# EAGLE design Sensact v4.1 (EAGLE 8.2.1)
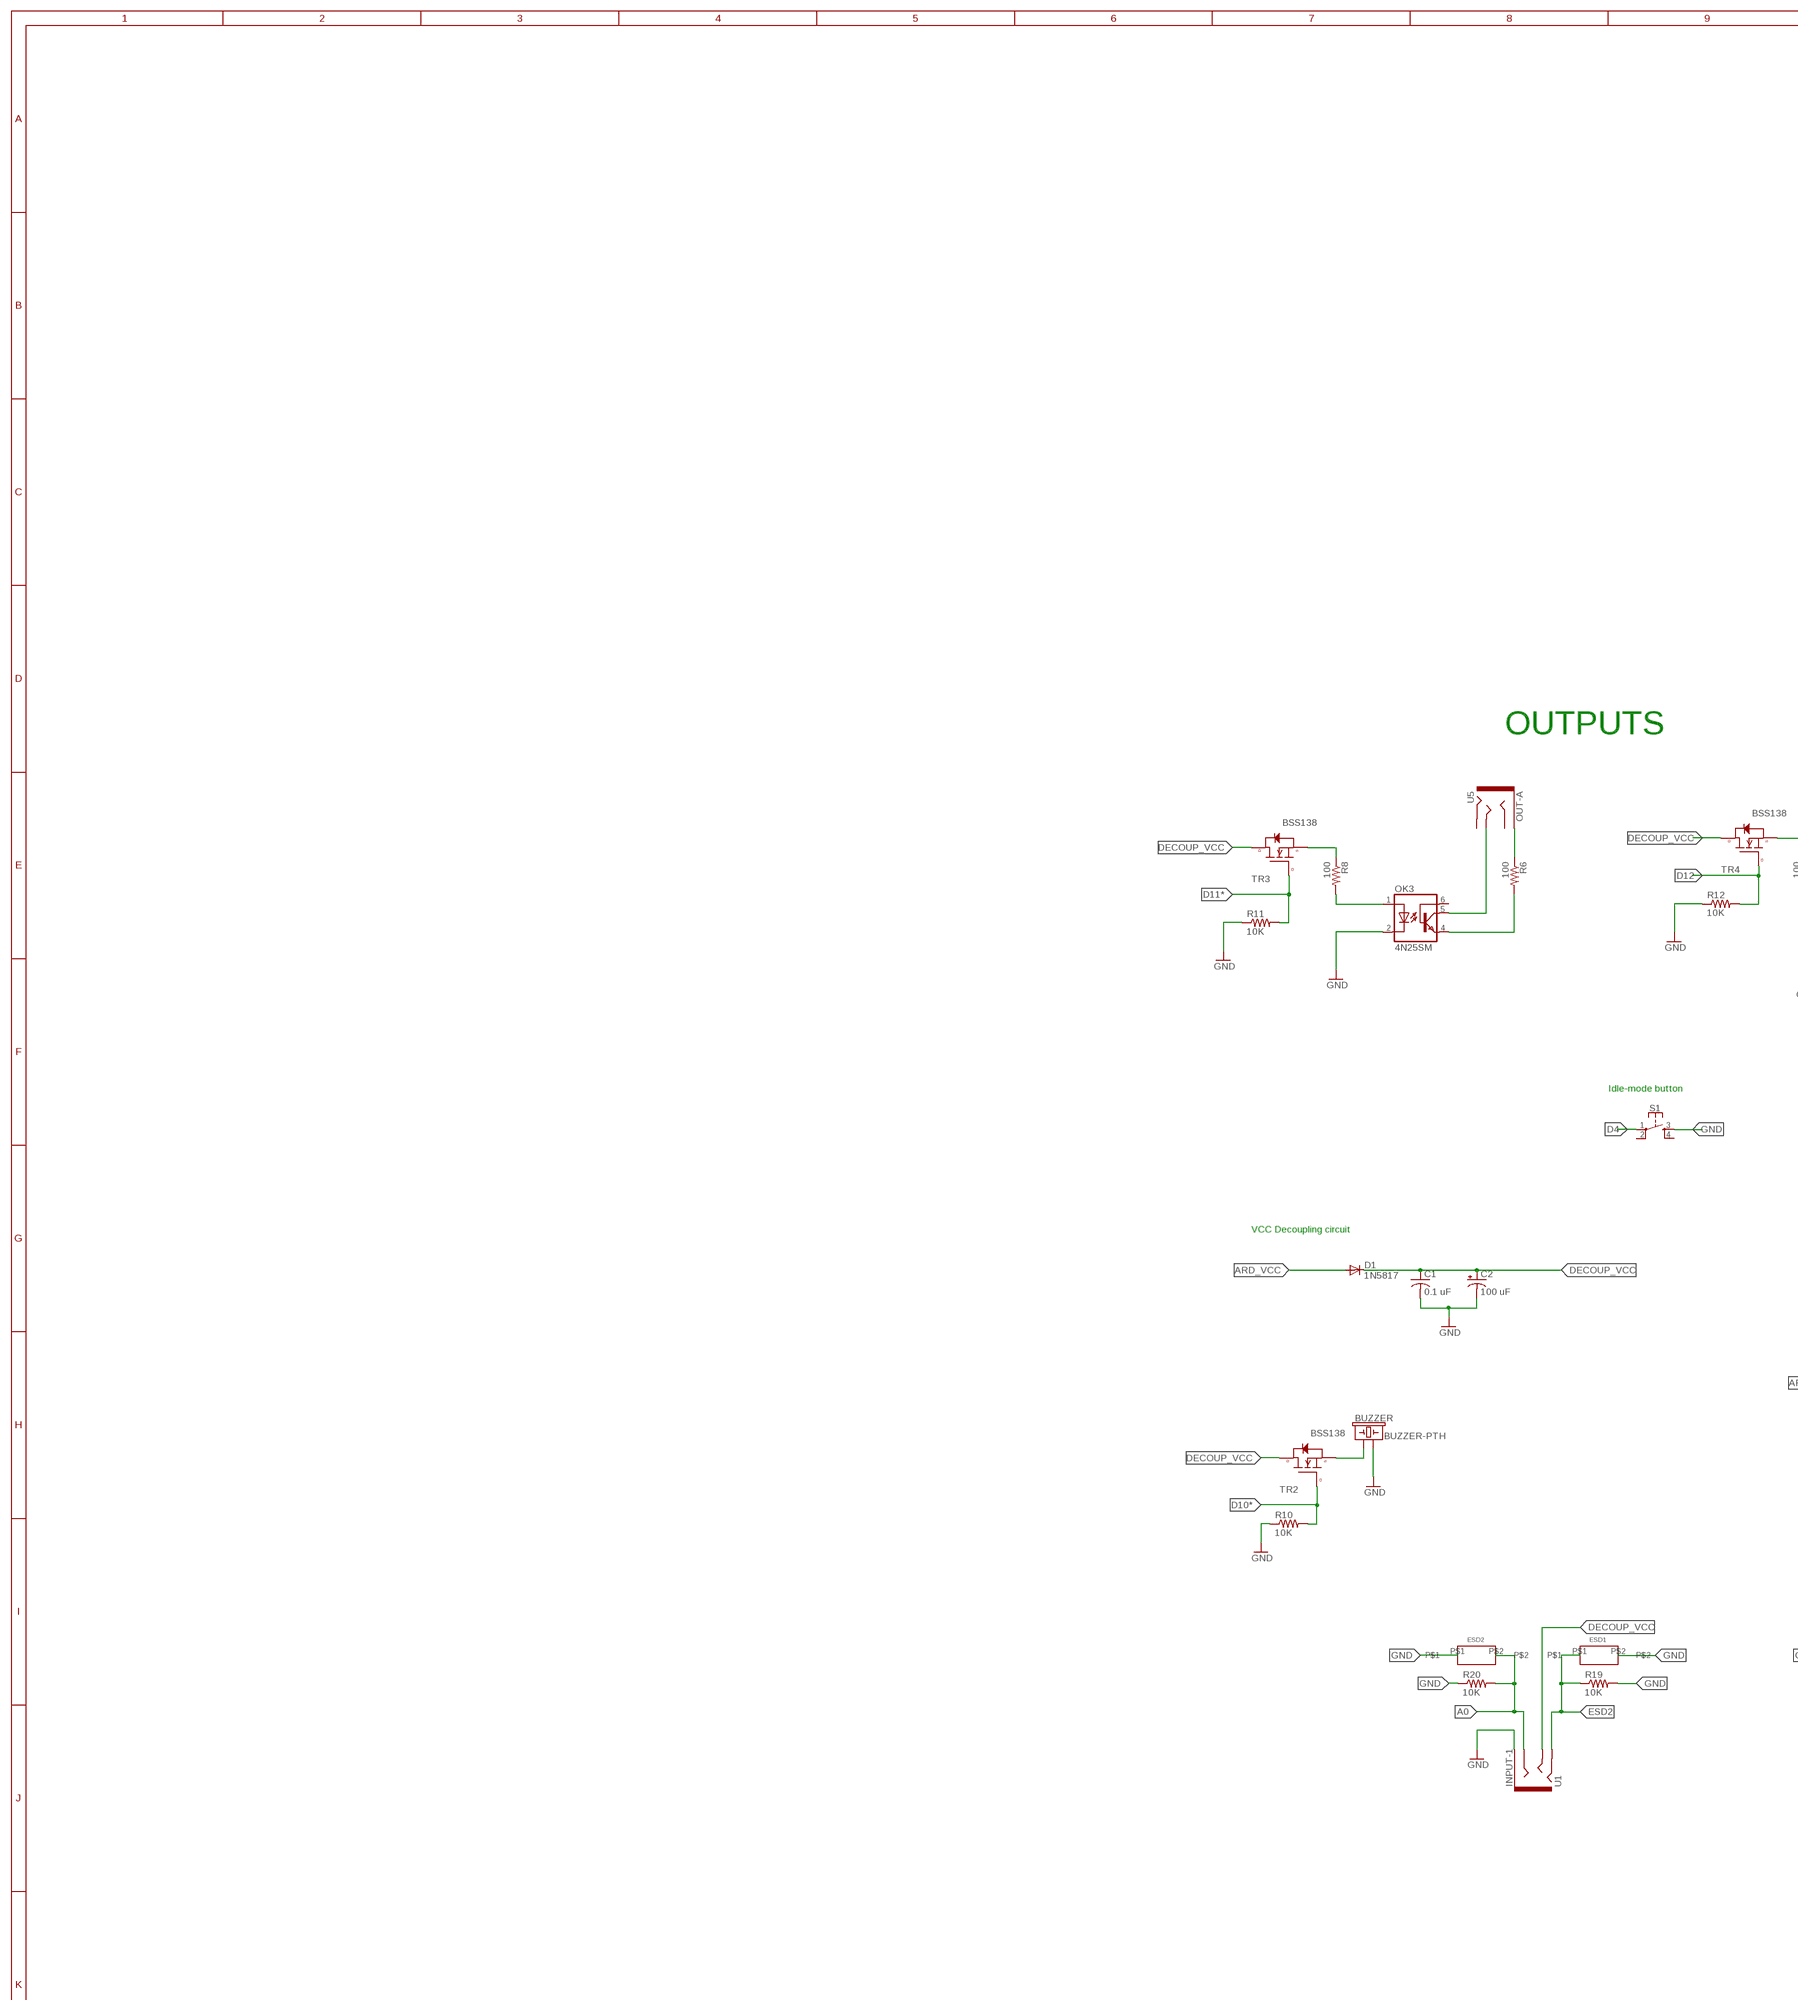
[diagram p0: schematic, sheet 1, part 1 of 3]
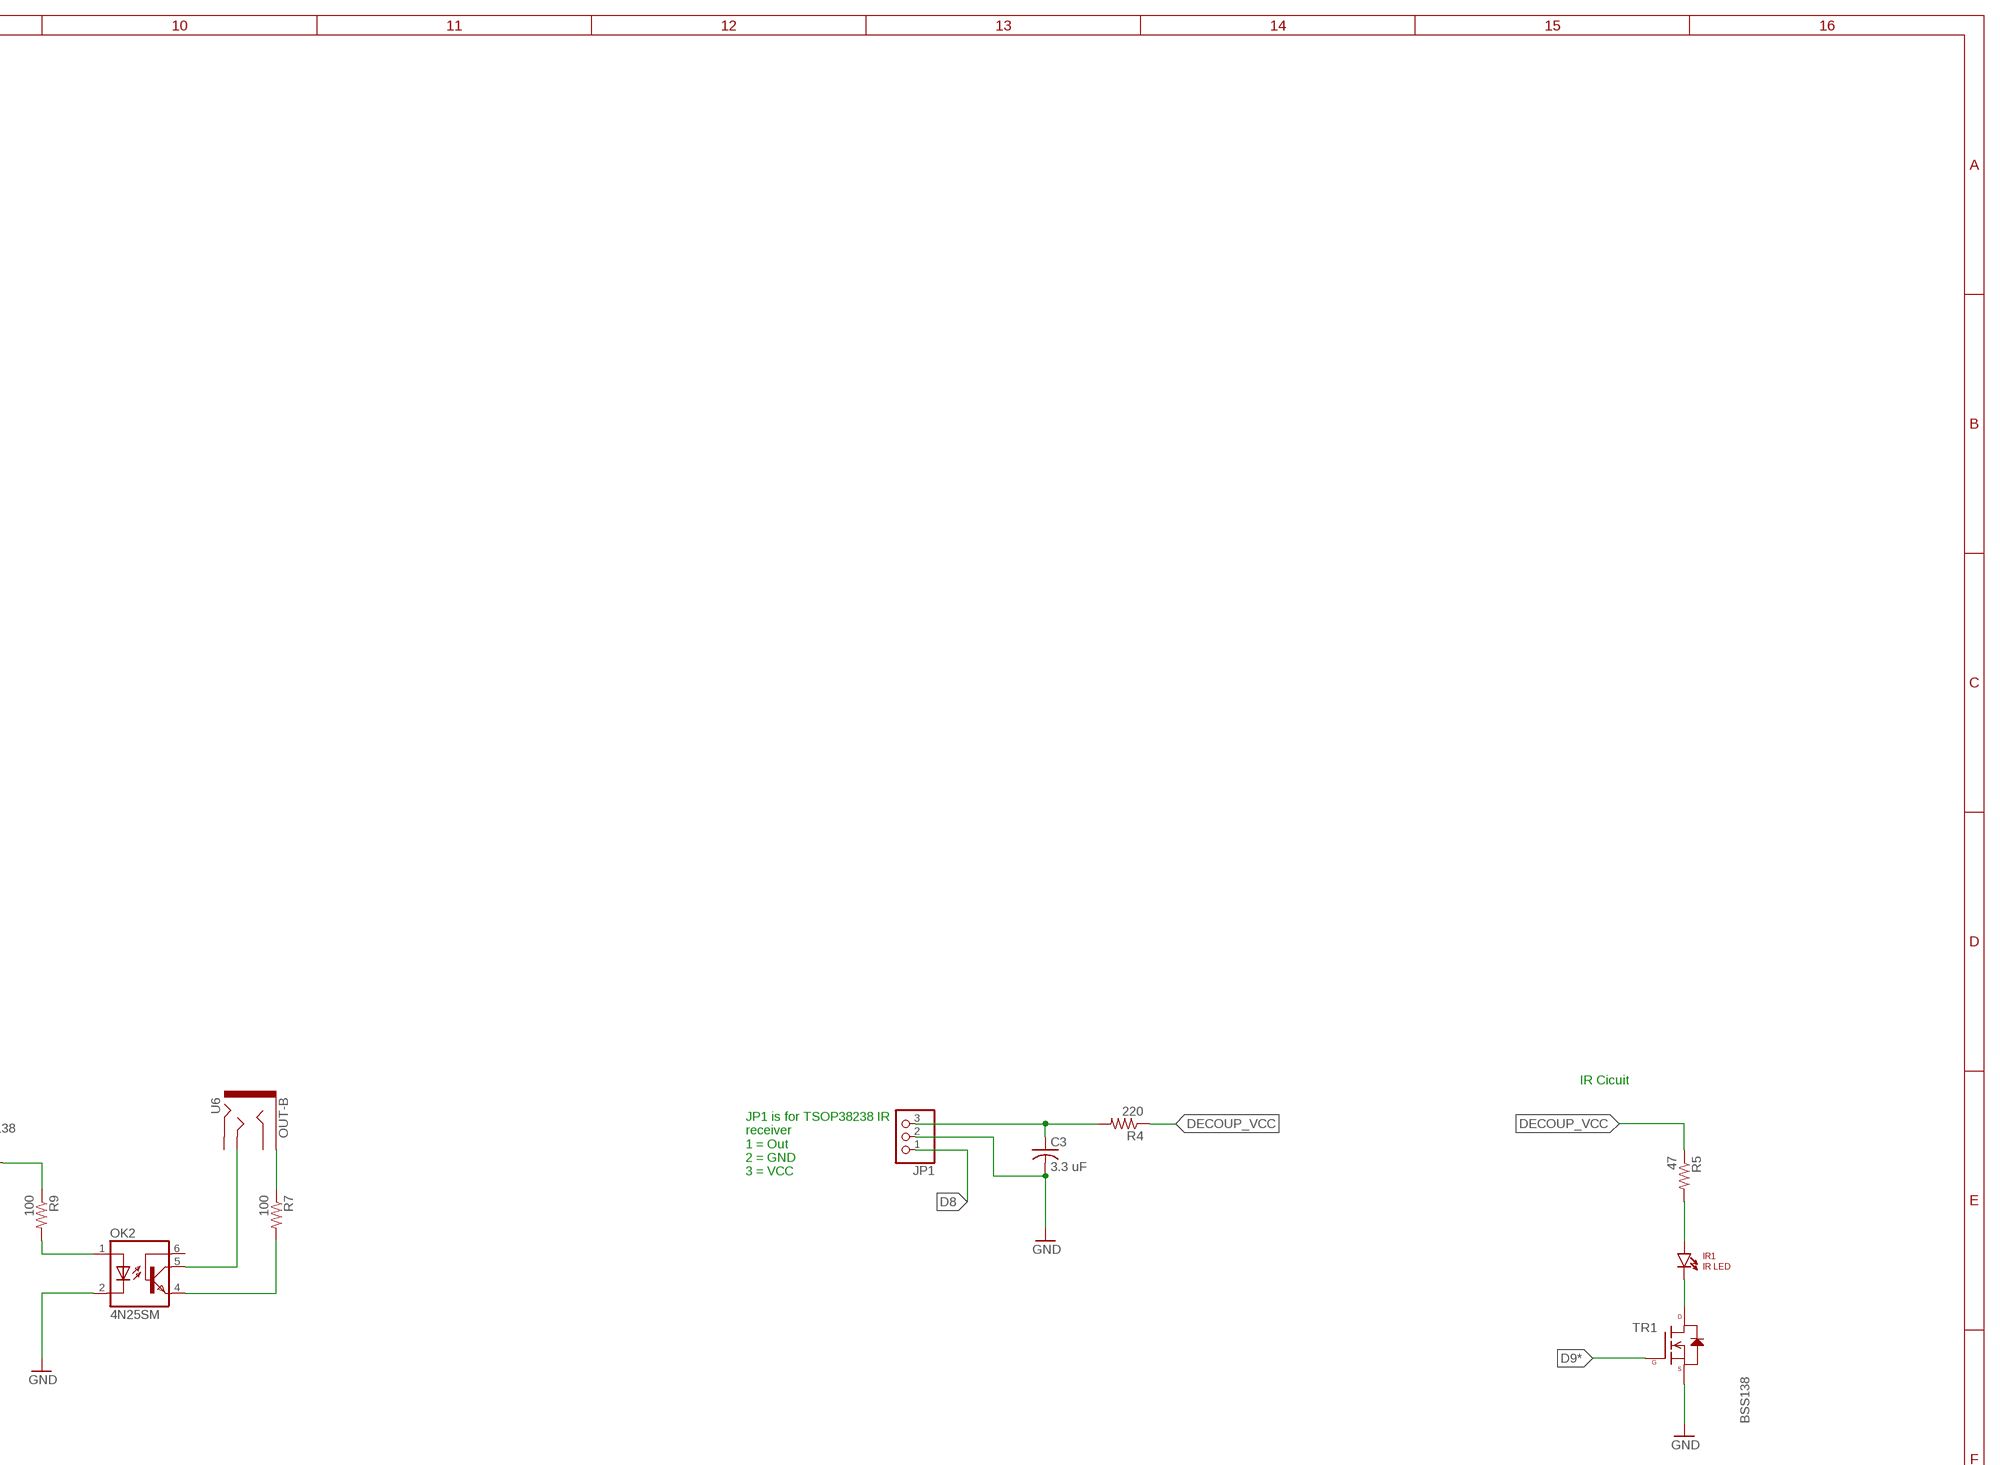
[diagram p1: schematic, sheet 1, part 2 of 3]
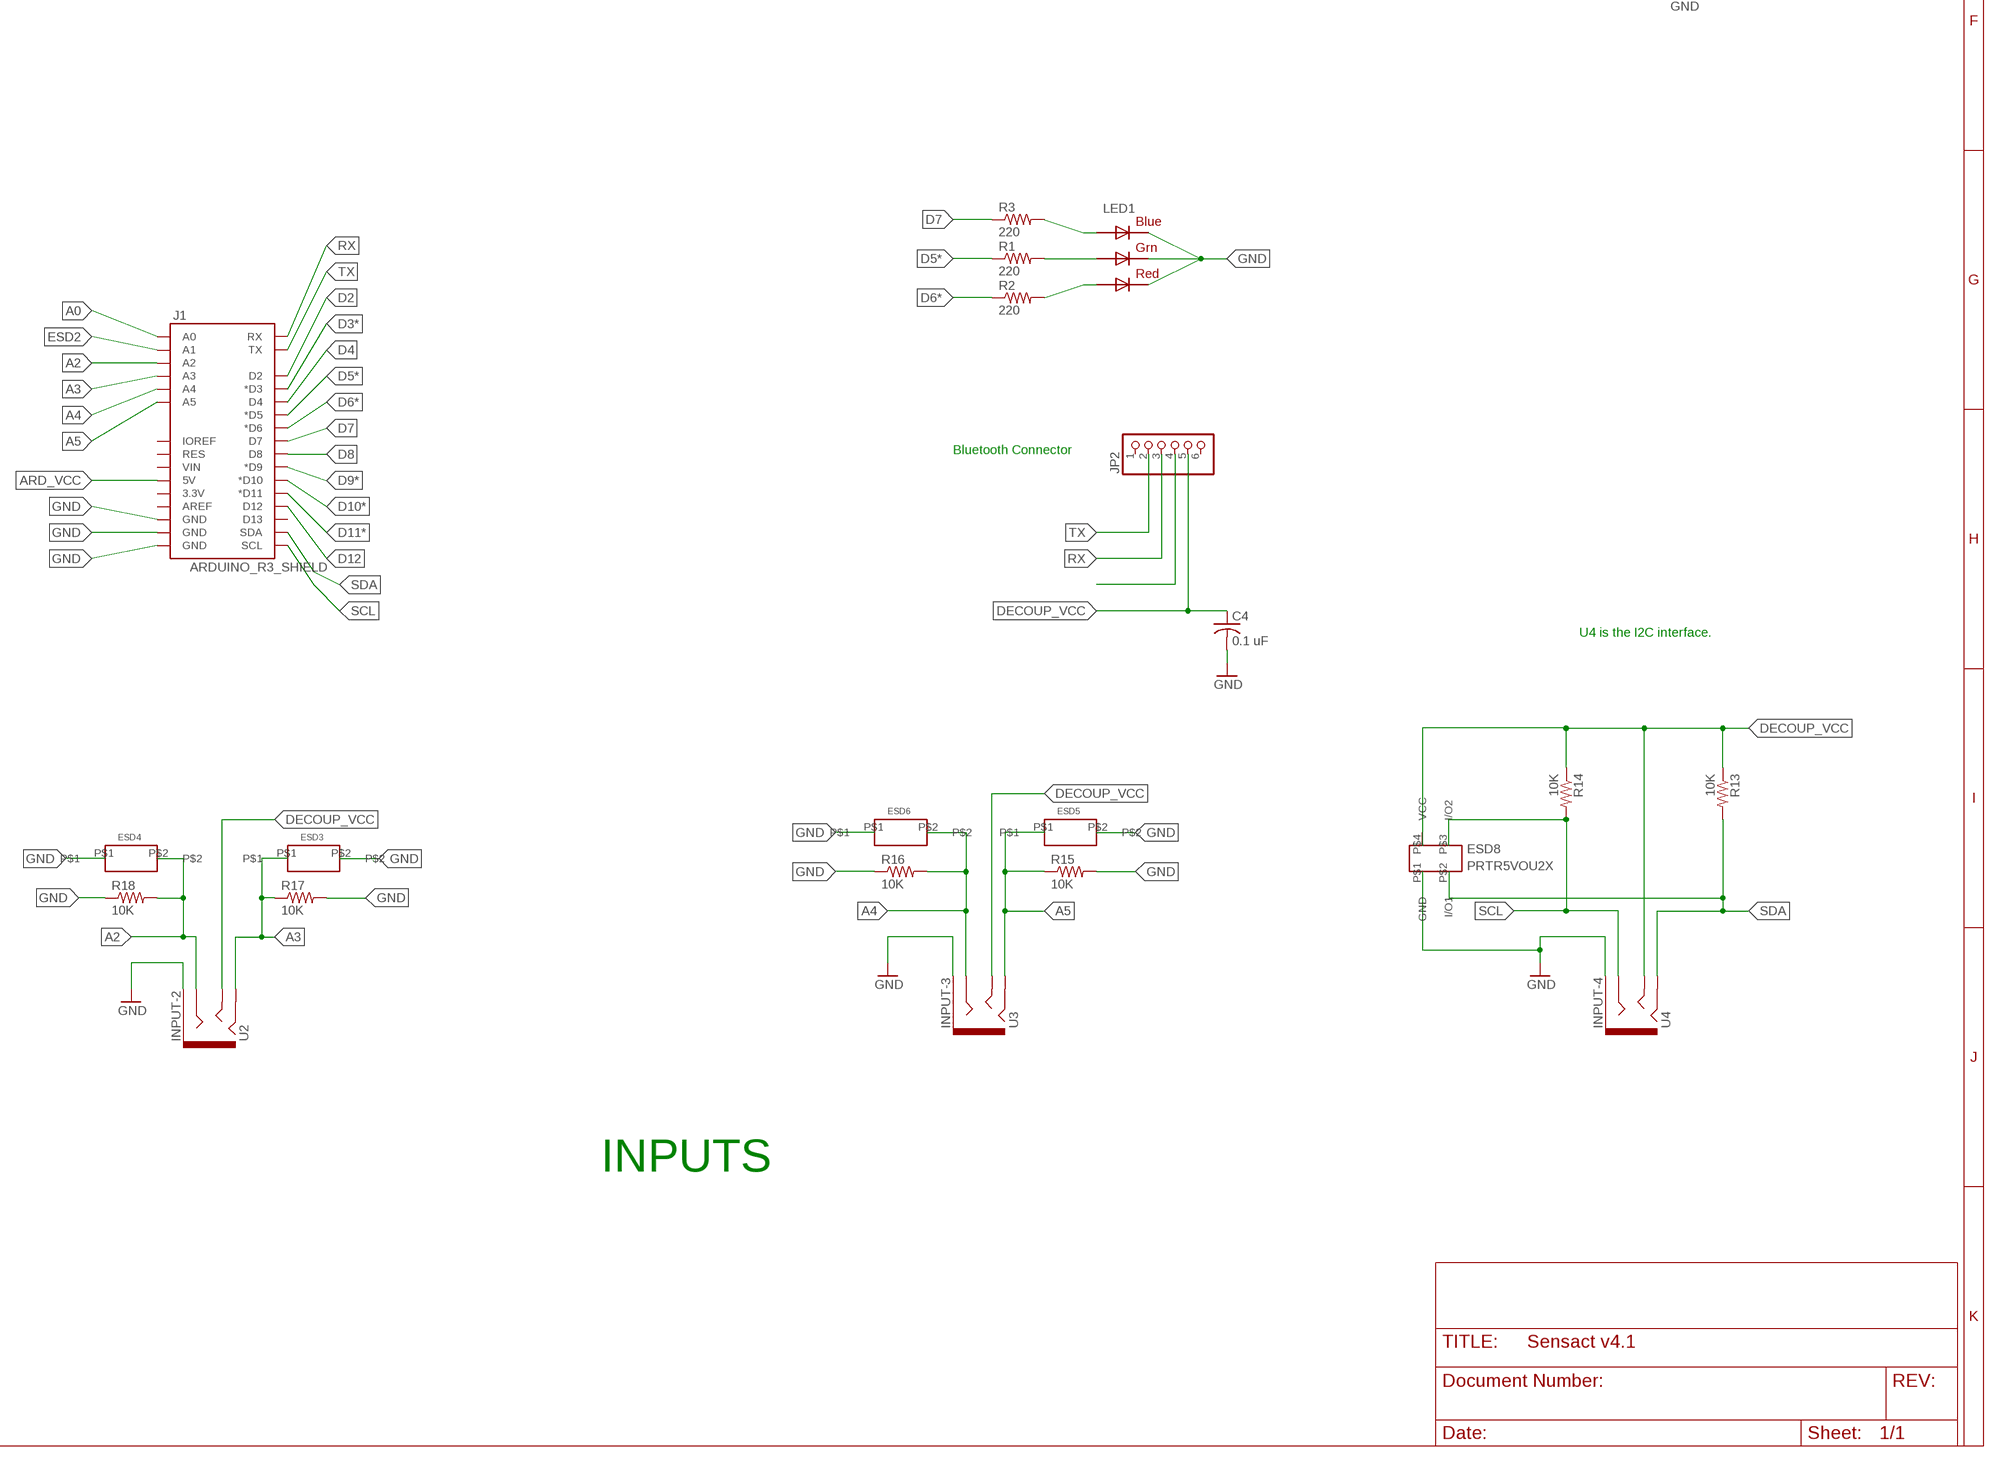
[diagram p2: schematic, sheet 1, part 3 of 3]

## Parts
BUZZER  BUZZER-PTH  [BUZZER-12MM]
C1  0.1 uF  C-USC0805  [C0805]
C2  100 uF  CAP_POLC  [PANASONIC_C]
C3  3.3 uF  C-USC0805  [C0805]
C4  0.1 uF  C-USC0805  [C0805]
D1  1N5817  DIODE-DO214AC  [DO214AC]
ESD1  PESD5V0S1BA  [SOD323]
ESD2  PESD5V0S1BA  [SOD323]
ESD3  PESD5V0S1BA  [SOD323]
ESD4  PESD5V0S1BA  [SOD323]
ESD5  PESD5V0S1BA  [SOD323]
ESD6  PESD5V0S1BA  [SOD323]
ESD8  PRTR5VOU2X  [215]
INPUT-1  U1  AUDIO-JACK-TRRS-THRUHOLE  [AUDIO-JACK-TRRS-THRUHOLE]
INPUT-2  U2  AUDIO-JACK-TRRS-THRUHOLE  [AUDIO-JACK-TRRS-THRUHOLE]
INPUT-3  U3  AUDIO-JACK-TRRS-THRUHOLE  [AUDIO-JACK-TRRS-THRUHOLE]
INPUT-4  U4  AUDIO-JACK-TRRS-THRUHOLE  [AUDIO-JACK-TRRS-THRUHOLE]
IR1  IR LED  LTE-302  [LTE-302]
J1  ARDUINO_R3_SHIELD  [UNO_R3_SHIELD]
JP1  PINHD-1X3  [1X03]
JP2  PINHD-1X6  [1X06]
LED1  RGBLED5050  [RGBLED5050]
OK2  4N25SM  [DIL6-SMD]
OK3  4N25SM  [DIL6-SMD]
OUT-A  U5  AUDIO-JACK-TRRS-THRUHOLE  [AUDIO-JACK-TRRS-THRUHOLE]
OUT-B  U6  AUDIO-JACK-TRRS-THRUHOLE  [AUDIO-JACK-TRRS-THRUHOLE]
R1  220  RESISTOR0805-RES  [0805]
R2  220  RESISTOR0805-RES  [0805]
R3  220  RESISTOR0805-RES  [0805]
R4  220  RESISTOR0805-RES  [0805]
R5  47  RESISTOR0805-RES  [0805]
R6  100  RESISTOR0805-RES  [0805]
R7  100  RESISTOR0805-RES  [0805]
R8  100  RESISTOR0805-RES  [0805]
R9  100  RESISTOR0805-RES  [0805]
R10  10K  RESISTOR0805-RES  [0805]
R11  10K  RESISTOR0805-RES  [0805]
R12  10K  RESISTOR0805-RES  [0805]
R13  10K  RESISTOR0805-RES  [0805]
R14  10K  RESISTOR0805-RES  [0805]
R15  10K  RESISTOR0805-RES  [0805]
R16  10K  RESISTOR0805-RES  [0805]
R17  10K  RESISTOR0805-RES  [0805]
R18  10K  RESISTOR0805-RES  [0805]
R19  10K  RESISTOR0805-RES  [0805]
R20  10K  RESISTOR0805-RES  [0805]
S1  MOMENTARY-SWITCH-SPST-2-SMD-4.6X2.8MM  [TACTILE_SWITCH_SMD_4.6X2.8MM]
TR1  BSS138  N-CHANNEL-MOSFET-BSS138  [SOT23-3]
TR2  BSS138  N-CHANNEL-MOSFET-BSS138  [SOT23-3]
TR3  BSS138  N-CHANNEL-MOSFET-BSS138  [SOT23-3]
TR4  BSS138  N-CHANNEL-MOSFET-BSS138  [SOT23-3]

## Nets
A0: ESD2.P$2 INPUT-1.RING1 J1.A0 R20.2
A2: ESD4.P$2 INPUT-2.RING1 J1.A2 R18.2
A3: ESD3.P$1 INPUT-2.RING2 J1.A3 R17.1
A4: ESD6.P$2 INPUT-3.RING1 J1.A4 R16.2
A5: ESD5.P$1 INPUT-3.RING2 J1.A5 R15.1
ARD_VCC: D1.A J1.5V
D2: J1.D2
D3*: J1.D3(*D3)
D4: J1.D4 S1.1
D5*: J1.D5(*D5) R1.1
D6*: J1.D6(*D6) R2.1
D7: J1.D7 R3.1
D8: J1.D8 JP1.1
D9*: J1.D9(*D9) TR1.1(G)
D10*: J1.D10(*D10) R10.2 TR2.1(G)
D11*: J1.D11(*D11) R11.2 TR3.1(G)
D12: J1.D12 R12.2 TR4.1(G)
DECOUP_VCC: C1.1 C2.+ C4.1 D1.C ESD8.P$4(VCC) INPUT-1.TIP INPUT-2.TIP INPUT-3.TIP INPUT-4.TIP JP2.5 R4.1 R5.1 R13.1 R14.1 TR2.3(D) TR3.3(D) TR4.3(D)
ESD2: ESD1.P$1 INPUT-1.RING2 J1.A1 R19.1
GND: BUZZER.- C1.2 C2.- C3.2 C4.2 ESD1.P$2 ESD2.P$1 ESD3.P$2 ESD4.P$1 ESD5.P$2 ESD6.P$1 ESD8.P$1(GND) INPUT-1.SLEEVE(EARTH) INPUT-2.SLEEVE(EARTH) INPUT-3.SLEEVE(EARTH) INPUT-4.SLEEVE(EARTH) J1.GND@0(GND) J1.GND@1(GND) J1.GND@2(GND) JP1.2 JP2.4 LED1.4(BLUE_C) LED1.5(RED_C) LED1.6(GREEN_C) OK2.2(C) OK3.2(C) R10.1 R11.1 R12.1 R15.2 R16.1 R17.2 R18.1 R19.2 R20.1 S1.3 TR1.2(S)
N$1: C3.1 JP1.3 R4.2
N$2: OK3.4(EMI) R6.2
N$3: OK2.1(A) R9.2
N$4: OK3.1(A) R8.2
N$5: LED1.3(BLUE_A) R3.2
N$6: LED1.1(GREEN_A) R1.2
N$7: LED1.2(RED_A) R2.2
N$8: OK3.5(COL) OUT-A.TIP
N$9: OUT-A.SLEEVE(EARTH) R6.1
N$10: OK2.5(COL) OUT-B.TIP
N$11: OUT-B.SLEEVE(EARTH) R7.1
N$12: OK2.4(EMI) R7.2
N$13: IR1.A R5.2
N$14: IR1.C TR1.3(D)
N$15: BUZZER.+ TR2.2(S)
N$16: R9.1 TR4.2(S)
N$19: R8.1 TR3.2(S)
RX: J1.RX JP2.3
SCL: ESD8.P$3(I/O2) INPUT-4.RING1 J1.SCL R14.2
SDA: ESD8.P$2(I/O1) INPUT-4.RING2 J1.SDA R13.2
TX: J1.TX JP2.2
Unconnected: J1.3.3V J1.AREF J1.D13 J1.IOREF J1.RES J1.VIN JP2.1 JP2.6 OK2.6(BAS) OK3.6(BAS) OUT-A.RING1 OUT-A.RING2 OUT-B.RING1 OUT-B.RING2 S1.2 S1.4

## Notes on the sheet
- OUTPUTS
- IR Cicuit
- JP1 is for TSOP38238 IR
  receiver
  1 = Out
  2 = GND
  3 = VCC
- Idle-mode button
- VCC Decoupling circuit
- Bluetooth Connector
- U4 is the I2C interface.
- INPUTS

## Library data of the parts
BUZZER = SparkFun-Electromechanical:BUZZER: Buzzer Small round buzzers that operate around the audible 2kHz range. You can use these as speakers to create simple music or user interfaces. Variant Overview: PTH - Mini Speaker - PC Mount 12mm 2.048kHz <https://www.sparkfun.com/products/7950> PTH_KIT - Mini Speaker - PC Mount 12mm 2.048kHz <https://www.sparkfun.com/products/7950> KIT simplifies soldering by adding stop mask to one side of the pads. PTH_NO_SILK - Mini Speaker - PC Mount 12mm 2.048kHz <https://www.sparkfun.com/products/7950> No silkscreen indicator of buzzer outline. PTH_KIT_NO_SILK - Mini Speaker - PC Mount 12mm 2.048kHz <https://www.sparkfun.com/products/7950> KIT package w/o silkscreen SMD - Buzzer Audio Magnetic (CCV-084B16) SMD buzzer used on, e.g. the LilyPad Buzzer <https://www.sparkfun.com/products/8463> and RFID USB Reader <https://www.sparkfun.com/products/9963>. SMD_KIT - Buzzer Audio Magnetic (CCV-084B16) SMD Buzzer with elongated pins to make soldering easier. Used on the SparkFun Simon Says - Surface Mount Soldering Kit <https://www.sparkfun.com/products/10935>.; PROD_ID: COMP-08253; SF_SKU: COM-07950
C1 C3 C4 = adafruit:C-US: CAPACITOR, American symbol
C2 = SparkFun-Capacitors:CAP_POL: Capacitor Polarized These are standard SMD and PTH capacitors. Normally 10uF, 47uF, and 100uF in electrolytic and tantalum varieties. Always verify the external diameter of the through hole cap, it varies with capacity, voltage, and manufacturer. The EIA devices should be standard.
D1 = diode:DIODE-: DIODE
ESD1-ESD6 = sdp:PESD5V0S1BA: ESD protection diode
ESD8 = sdp:PRTR5VOU2X: ESD Protection for I2C lines.
INPUT-1-INPUT-4 OUT-A OUT-B = bruce_library:AUDIO-JACK-TRRS-THRUHOLE
IR1 = SparkFun-LED:LTE-302: Through-hole side-firing 940nm IR LED
J1 = SparkFun-Boards:ARDUINO_R3_SHIELD: Shield form compatible with the Arduino Uno R3.
JP1 = adafruit:PINHD-1X3: PIN HEADER
JP2 = adafruit:PINHD-1X6: PIN HEADER
LED1 = adafruit:RGBLED: For 5050 RGB LEDs, the order of the LEDs may vary from one manufacturer to another!
OK2 OK3 = optocoupler:4N*?M: General Purpose 6-Pin Phototransistor Optocouplers Source: http://www.fairchildsemi.com/ds/4N/4N35-M.pdf; MF: FAIRCHILD SEMICONDUCTOR; MPN: 4N25SM; OC_FARNELL: 1021152; OC_NEWARK: 34C2020
R1-R20 = SparkFun-Passives:RESISTOR: Resistor Basic schematic elements and footprints for 0603, 1206, and PTH resistors.
S1 = SparkFun-Switches:MOMENTARY-SWITCH-SPST-2: Momentary Switch (Pushbutton) - SPST - Two Circuits Normally-open (NO) SPST momentary switches (buttons, pushbuttons). Schematic symbol includes two switch circuits. Variants SMD-4.6MMX2.8MM - 4.60mm x 2.80mm Tactile Momentary Button Switch - Used on SparkFun SAMD21 Mini Breakout <https://www.sparkfun.com/products/13664> SMD-5.2MM - Mini Pushbutton Switch - SMD <https://www.sparkfun.com/products/8720> - Used on Arduino Pro Mini <https://www.sparkfun.com/products/11114>; PROD_ID: SWCH-13065
TR1-TR4 = GeekAmmo:N-CHANNEL-MOSFET: N-Channel MOSFET Mode Field Effect Transistor; DATASHEET: http://www.fairchildsemi.com/ds/BS/BSS138.pdf; DIGIKEY: BSS138TR-ND; ELEMENT14: 2323154; URL: http://au.element14.com/fairchild-semiconductor/bss138/mosfet-n-ch-50v-220ma-sot-23/dp/2323154

## Net classes
0 default: width 0.305 mm, drill 0.508 mm, clearance 0.254 mm

## Board
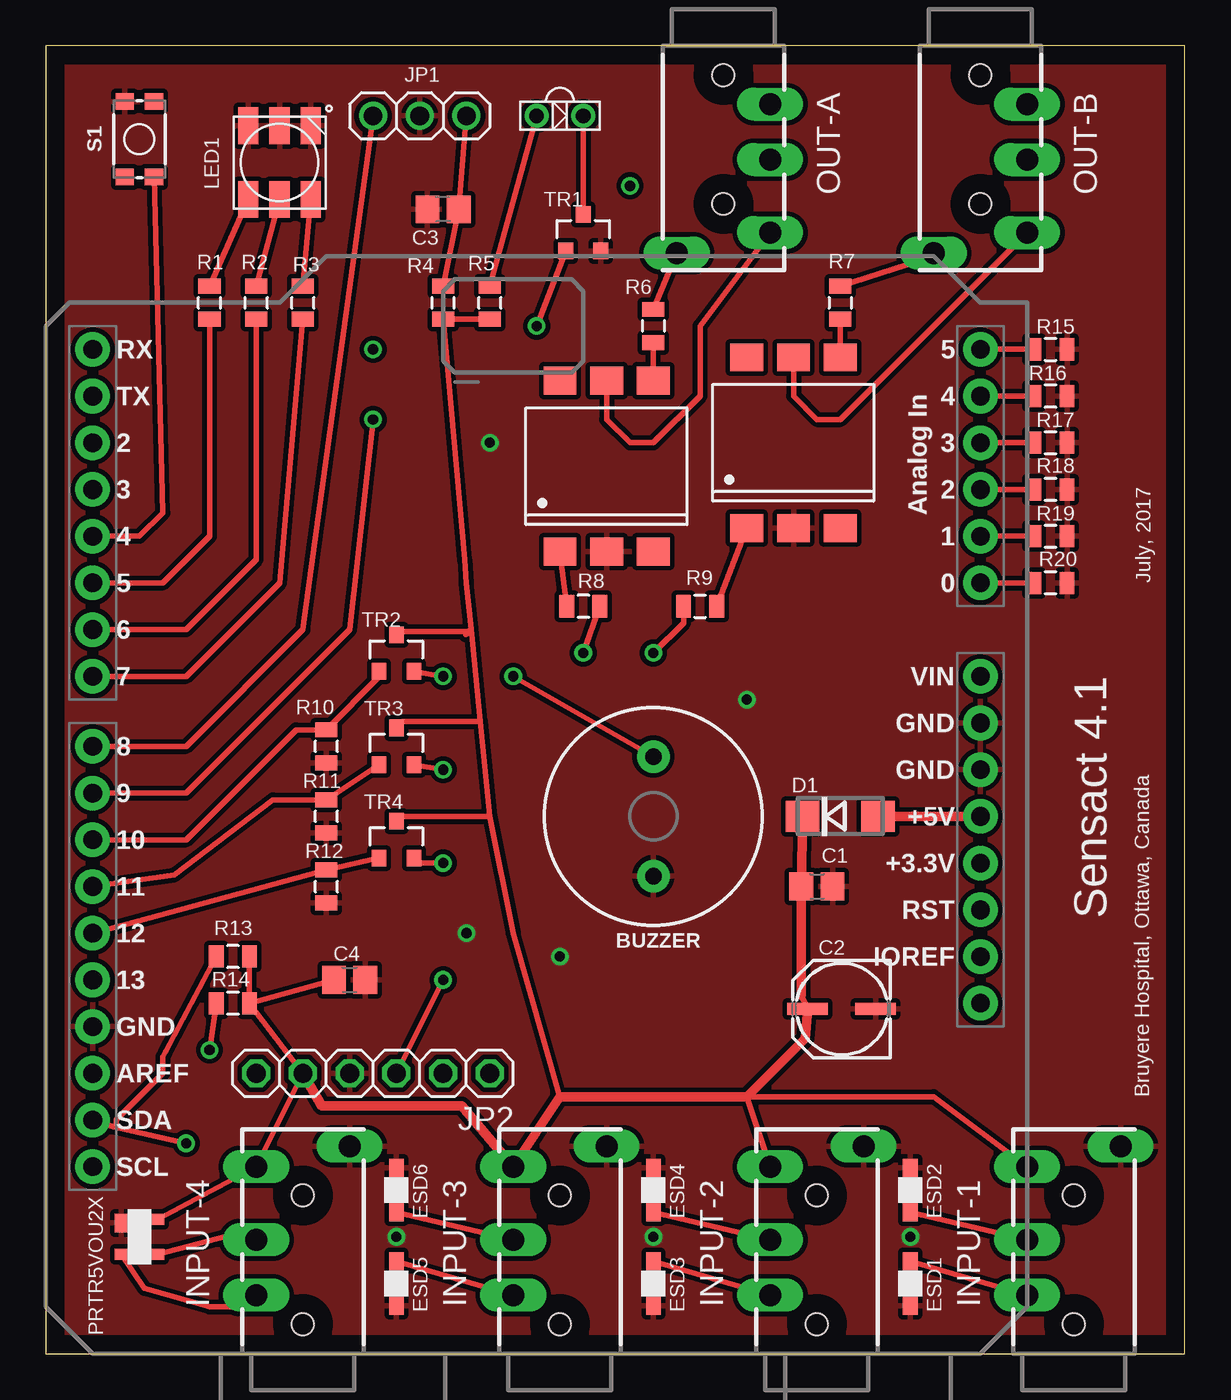
[diagram p3: board, top side]
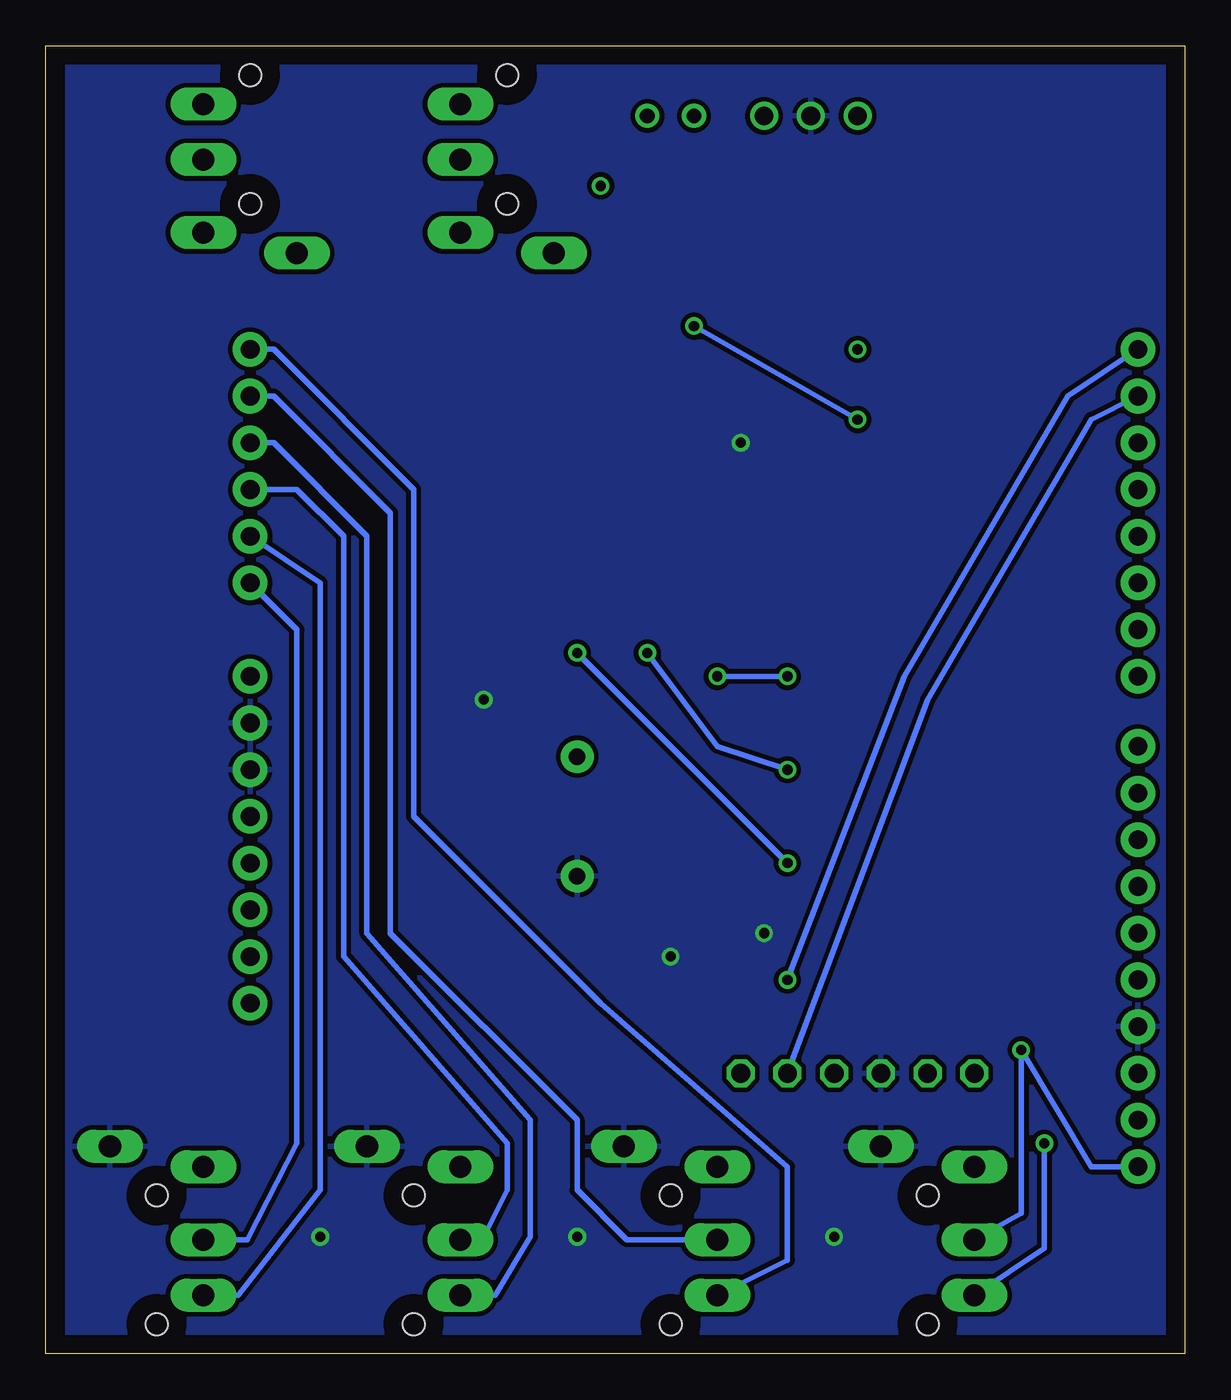
[diagram p4: board, bottom side, seen from below]

Size 61.9 x 71.11 mm. Coordinates in mm from the lower left corner, seen from the top.
Outline: 0,0 61.9,0 61.9,71.11 0,71.11 0,0
Copper layers (1*16): Top 0.035mm / dielectric 1.5mm / Bottom 0.035mm
Design rules "default": minimum track width 6mil, minimum drill 0.35mm, track to track 6mil, track to pad 6mil, pad to pad 6mil, via to via 6mil, smd to smd 6mil, copper to edge 40mil, drill to drill 6mil, minimum pad ring 10mil, minimum via ring 8mil, stop-mask expansion 4mil, vias tented up to drill 0mil, thermal gap 10mil

### Footprints (pad centres in the part's own frame; a part is rotated, then mirrored left to right if it is on the bottom)
BUZZER-12MM = drill 0.9 pad 1.778: + 3.25,0; - -3.25,0
C0805 = smd 1.3 x 1.5: 1 -0.85,0; 2 0.85,0
PANASONIC_C = smd 2.2 x 0.65: + 1.9,-0.2; - -1.8,-0.2
DO214AC = smd 1.8 x 1.7: A 2.05,0; C -2.05,0
SOD323 = smd 1 x 0.8: P$1 -1.2,0; P$2 1.2,0
215 = smd 1 x 0.7: P$1 -0.75,-1 | smd 0.6 x 0.7: P$2 0.95,-1; P$3 0.95,1; P$4 -0.95,1
AUDIO-JACK-TRRS-THRUHOLE = drill 1.2 long: RING1 6.191,2.54; RING2 3.175,2.54; SLEEVE 11.271,-2.54; TIP 10.16,2.54 | hole 1.2: 1.6,0; 8.6,0
LTE-302 = drill 0.8: A 1.27,0; C -1.27,0
UNO_R3_SHIELD = drill 1.016 pad 1.88: 3.3V 50.8,26.67; 5V 50.8,29.21; A0 50.8,41.91; A1 50.8,44.45; A2 50.8,46.99; A3 50.8,49.53; A4 50.8,52.07; A5 50.8,54.61; AREF 2.54,15.24; D2 2.54,49.53; D3 2.54,46.99; D4 2.54,44.45; D5 2.54,41.91; D6 2.54,39.37; D7 2.54,36.83; D8 2.54,33.02; D9 2.54,30.48; D10 2.54,27.94; D11 2.54,25.4; D12 2.54,22.86; D13 2.54,20.32; GND@0 50.8,31.75; GND@1 50.8,34.29; GND@2 2.54,17.78; IOREF 50.8,21.59; NC 50.8,19.05; RES 50.8,24.13; RX 2.54,54.61; SCL 2.54,10.16; SDA 2.54,12.7; TX 2.54,52.07; VIN 50.8,36.83
1X03 = drill 1.016: 1 -2.54,0; 2 0,0; 3 2.54,0
1X06 = drill 1.016 octagon: 1 -6.35,0; 2 -3.81,0; 3 -1.27,0; 4 1.27,0; 5 3.81,0; 6 6.35,0
RGBLED5050 = smd 2 x 1.1: 1 -2,1.7; 2 -2,0; 3 -2,-1.7; 4 2,-1.7; 5 2,0; 6 2,1.7
DIL6-SMD = smd 1.78 x 1.52: 1 -2.54,-4.645; 2 0,-4.645; 3 2.54,-4.645; 4 2.54,4.645; 5 0,4.645; 6 -2.54,4.645
0805 = smd 0.8 x 1.2: 1 -0.9,0; 2 0.9,0
TACTILE_SWITCH_SMD_4.6X2.8MM = smd 0.9 x 1: 1 -2.05,-0.8; 2 2.05,-0.8; 3 2.05,0.8; 4 -2.05,0.8
SOT23-3 = smd 0.8 x 0.9: 1 -0.95,-1; 2 0.95,-1; 3 0,1

### Placement (x,y rotation side)
BUZZER  33.02,29.21 90 top
C1  41.91,25.4 0 top
C2  43.31,18.54 180 top
C3  21.59,62.23 180 top
C4  16.51,20.32 0 top
D1  43.18,29.21 0 top
ESD1  46.99,3.81 270 top
ESD2  46.99,8.89 270 top
ESD3  33.02,3.81 270 top
ESD4  33.02,8.89 270 top
ESD5  19.05,3.81 270 top
ESD6  19.05,8.89 270 top
ESD8  5.08,6.35 270 top
INPUT-1  55.88,0 90 top
INPUT-2  41.91,0 90 top
INPUT-3  27.94,0 90 top
INPUT-4  13.97,0 90 top
IR1  27.94,67.31 180 top
J1  0,0 0 top
JP1  20.32,67.31 0 top
JP2  17.78,15.24 180 top
LED1  12.7,64.77 90 top
OK2  40.64,49.53 0 top
OK3  30.48,48.26 0 top
OUT-A  36.83,71.12 270 top
OUT-B  50.8,71.12 270 top
R1  8.89,57.15 90 top
R2  11.43,57.15 90 top
R3  13.97,57.15 90 top
R4  21.59,57.15 90 top
R5  24.13,57.15 90 top
R6  33.02,55.88 270 top
R7  43.18,57.15 270 top
R8  29.21,40.64 180 top
R9  35.56,40.64 0 top
R10  15.24,33.02 90 top
R11  15.24,29.21 90 top
R12  15.24,25.4 90 top
R13  10.16,21.59 180 top
R14  10.16,19.05 180 top
R15  54.61,54.61 0 top
R16  54.61,52.07 180 top
R17  54.61,49.53 0 top
R18  54.61,46.99 180 top
R19  54.61,44.45 0 top
R20  54.61,41.91 180 top
S1  5.08,66.04 90 top
TR1  29.21,60.96 0 top
TR2  19.05,38.1 0 top
TR3  19.05,33.02 0 top
TR4  19.05,27.94 0 top

### Tracks (layer width: path | path; a pad name or v marks a point on that pad's centre or on a via)
A0
  Top 0.305: J1.A0 R20.2 | ESD2.P$2 INPUT-1.RING1
  Bottom 0.305: INPUT-1.RING1 50.96,6.19 48.26,11.43 48.26,39.37 J1.A0
A2
  Top 0.305: ESD4.P$2 INPUT-2.RING1 | J1.A2 R18.2
  Bottom 0.305: INPUT-2.RING1 38.1,6.35 36.83,8.89 36.83,11.43 45.72,21.59 45.72,44.45 48.26,46.99 J1.A2
A3
  Top 0.305: J1.A3 R17.1 | ESD3.P$1 INPUT-2.RING2
  Bottom 0.305: INPUT-2.RING2 37.47,3.17 35.56,6.35 35.56,12.7 44.45,22.86 44.45,44.45 49.53,49.53 J1.A3
A4
  Top 0.305: J1.A4 R16.2 | ESD6.P$2 INPUT-3.RING1
  Bottom 0.305: INPUT-3.RING1 30.32,6.19 33.02,8.89 33.02,12.7 43.18,22.86 43.18,45.72 49.53,52.07 J1.A4
A5
  Top 0.305: ESD5.P$1 INPUT-3.RING2 | J1.A5 R15.1
  Bottom 0.305: INPUT-3.RING2 21.59,5.08 21.59,10.16 31.75,19.05 41.91,29.21 41.91,46.99 49.53,54.61 J1.A5
ARD_VCC
  Top 0.508: J1.5V 47.77,29.21 D1.A
D4
  Top 0.305: J1.D4 5.08,44.45 6.35,45.72 S1.1
D5*
  Top 0.305: J1.D5 6.35,41.91 8.89,44.45 R1.1
D6*
  Top 0.305: J1.D6 7.62,39.37 11.43,43.18 R2.1
D7
  Top 0.305: J1.D7 7.62,36.83 12.7,41.91 R3.1
D8
  Top 0.305: J1.D8 7.62,33.02 13.97,39.37 JP1.1
D9*  (via drill 0.55)
  Top 0.305: J1.D9 7.62,30.48 16.51,39.37 v17.78,50.8 | v26.67,55.88 TR1.1
  Bottom 0.305: v17.78,50.8 v26.67,55.88
D10*
  Top 0.305: J1.D10 7.62,27.94 13.6,33.92 R10.2 18.1,36.78 TR2.1
D11*
  Top 0.305: J1.D11 6.99,26.04 12.33,30.11 R11.2 TR3.1
D12
  Top 0.305: TR4.1 R12.2 J1.D12
DECOUP_VCC
  Top 0.305: 41.06,19.47 C2.+ | INPUT-2.TIP 38.1,13.97 48.26,13.97 INPUT-1.TIP | R14.1 JP2.5 INPUT-4.TIP ESD8.P$4 | R5.1 R4.1 22.76,43.17 22.86,41.91 23.11,39.4 | R14.1 C4.1 | R14.1 R13.1 | 27.94,13.97 25.4,22.86 24.13,29.21 | 23.61,34.37 23.11,39.4 | 23.61,34.37 24.13,29.21 | 22.97,39.26 22.82,39.1 | 22.97,39.26 23.11,39.4 | TR2.3 19.21,39.26 22.97,39.26 | TR3.3 19.39,34.37 23.61,34.37 | TR4.3 19.32,29.21 24.13,29.21
  Top 0.508: 41.06,19.47 C1.1 D1.C | C2.+ 41.28,17.15 38.1,13.97 27.94,13.97 INPUT-3.TIP 22.61,13.46 14.99,13.46 JP2.5
ESD2
  Top 0.305: R19.1 J1.A1 | ESD1.P$1 INPUT-1.RING2
  Bottom 0.305: INPUT-1.RING2 51.44,3.17 46.99,8.89 46.99,41.91 J1.A1
GND  (via drill 0.55)
  other vias: 38.1,35.56 24.13,49.53 19.05,6.35 22.86,22.86 27.94,21.59 33.02,6.35 46.99,6.35
  pour Top: -1.27,72.39 -1.27,-1.27 60.96,-1.27 60.96,72.39
  pour Bottom: -1.27,72.39 -1.27,-1.27 60.96,-1.27 60.96,72.39
N$1
  Top 0.305: R4.2 C3.1 JP1.3
N$2
  Top 0.305: OK3.4 R6.2
N$3
  Top 0.305: R9.2 OK2.1
N$4
  Top 0.305: R8.2 OK3.1
N$5
  Top 0.305: R3.2 LED1.3
N$6
  Top 0.305: R1.2 LED1.1
N$7
  Top 0.305: R2.2 LED1.2
N$8
  Top 0.305: OK3.5 30.48,50.8 31.75,49.53 33.02,49.53 35.56,52.07 35.56,55.88 OUT-A.TIP
N$9
  Top 0.305: R6.1 OUT-A.SLEEVE
N$10
  Top 0.305: OK2.5 40.64,52.07 41.91,50.8 43.18,50.8 OUT-B.TIP
N$11
  Top 0.305: R7.1 48.26,59.69 46.99,59.69 OUT-B.SLEEVE
N$12
  Top 0.305: OK2.4 R7.2
N$13
  Top 0.305: R5.2 IR1.A
N$14
  Top 0.305: IR1.C TR1.3
N$15  (via drill 0.55)
  Top 0.305: TR2.2 v21.59,36.83 | v25.4,36.83 BUZZER.+
  Bottom 0.305: v21.59,36.83 v25.4,36.83
N$16  (via drill 0.55)
  Top 0.305: TR4.2 20.27,26.67 v21.59,26.67 | v33.02,38.1 34.66,39.74 R9.1
  Bottom 0.305: v21.59,26.67 v33.02,38.1
N$19  (via drill 0.55)
  Top 0.305: TR3.2 v21.59,31.75 | v29.21,38.1 R8.1
  Bottom 0.305: v21.59,31.75 25.4,33.02 v29.21,38.1
N$21  (via drill 0.55)
  other vias: 31.75,63.5
N$24  (via drill 0.55)
  other vias: 17.78,54.61
RX  (via drill 0.55)
  Top 0.305: v21.59,20.32 JP2.3
  Bottom 0.305: J1.RX 6.35,52.07 15.24,36.83 v21.59,20.32
SCL  (via drill 0.55)
  Top 0.305: ESD8.P$3 10.95,6.67 INPUT-4.RING1 | R14.2 v8.89,16.51
  Bottom 0.305: J1.SCL 5.08,10.16 v8.89,16.51 8.89,7.62 INPUT-4.RING1
SDA  (via drill 0.55)
  Top 0.305: 3.68,12.32 J1.SDA | 3.68,12.32 v7.62,11.43 | R13.2 6.5,16.43 6.35,16.14 6.35,15.24 3.81,12.7 3.81,12.45 3.68,12.32 | ESD8.P$2 5.35,3.54 8.89,2.54 10.79,2.54 INPUT-4.RING2
  Bottom 0.305: v7.62,11.43 7.62,5.71 INPUT-4.RING2
TX
  Bottom 0.305: J1.TX 5.08,50.8 13.97,35.56 JP2.2

### Text on the board
tNames: July, 2017 | Sensact 4.1 | Bruyere Hospital, Ottawa, Canada